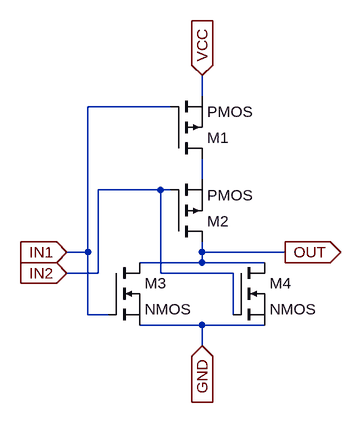
[diagram p0: schematic nor.asc]
nor.asc, the LTspice schematic file:
Version 4.1
SHEET 1 880 680
WIRE 176 -80 176 -112
WIRE 128 -64 0 -64
WIRE 176 48 176 16
WIRE 112 64 16 64
WIRE 128 64 112 64
WIRE 0 160 0 -64
WIRE 0 160 -32 160
WIRE 176 160 176 144
WIRE 304 160 176 160
WIRE 176 176 176 160
WIRE 176 176 80 176
WIRE 272 176 176 176
WIRE 16 192 16 64
WIRE 16 192 -32 192
WIRE 112 192 112 64
WIRE 224 192 112 192
WIRE 0 256 0 160
WIRE 32 256 0 256
WIRE 224 256 224 192
WIRE 176 272 80 272
WIRE 272 272 176 272
WIRE 176 304 176 272
FLAG -32 160 IN1
IOPIN -32 160 In
FLAG 304 160 OUT
IOPIN 304 160 Out
FLAG -32 192 IN2
IOPIN -32 192 In
FLAG 176 -112 VCC
IOPIN 176 -112 In
FLAG 176 304 GND
IOPIN 176 304 In
SYMBOL pmos 128 16 M180
SYMATTR InstName M1
SYMBOL pmos 128 144 M180
SYMATTR InstName M2
SYMBOL nmos 32 176 R0
SYMATTR InstName M3
SYMBOL nmos 224 176 R0
SYMATTR InstName M4

The netlist it stands for:
* nor.asc
M1 N001 IN1 VCC VCC PMOS
M2 OUT IN2 N001 N001 PMOS
M3 OUT IN1 GND GND NMOS
M4 OUT IN2 GND GND NMOS
.model NMOS NMOS
.model PMOS PMOS
.lib standard.mos
.backanno
.end